# EAGLE schematic canSlaveV05 Abm (EAGLE 6.5.0)
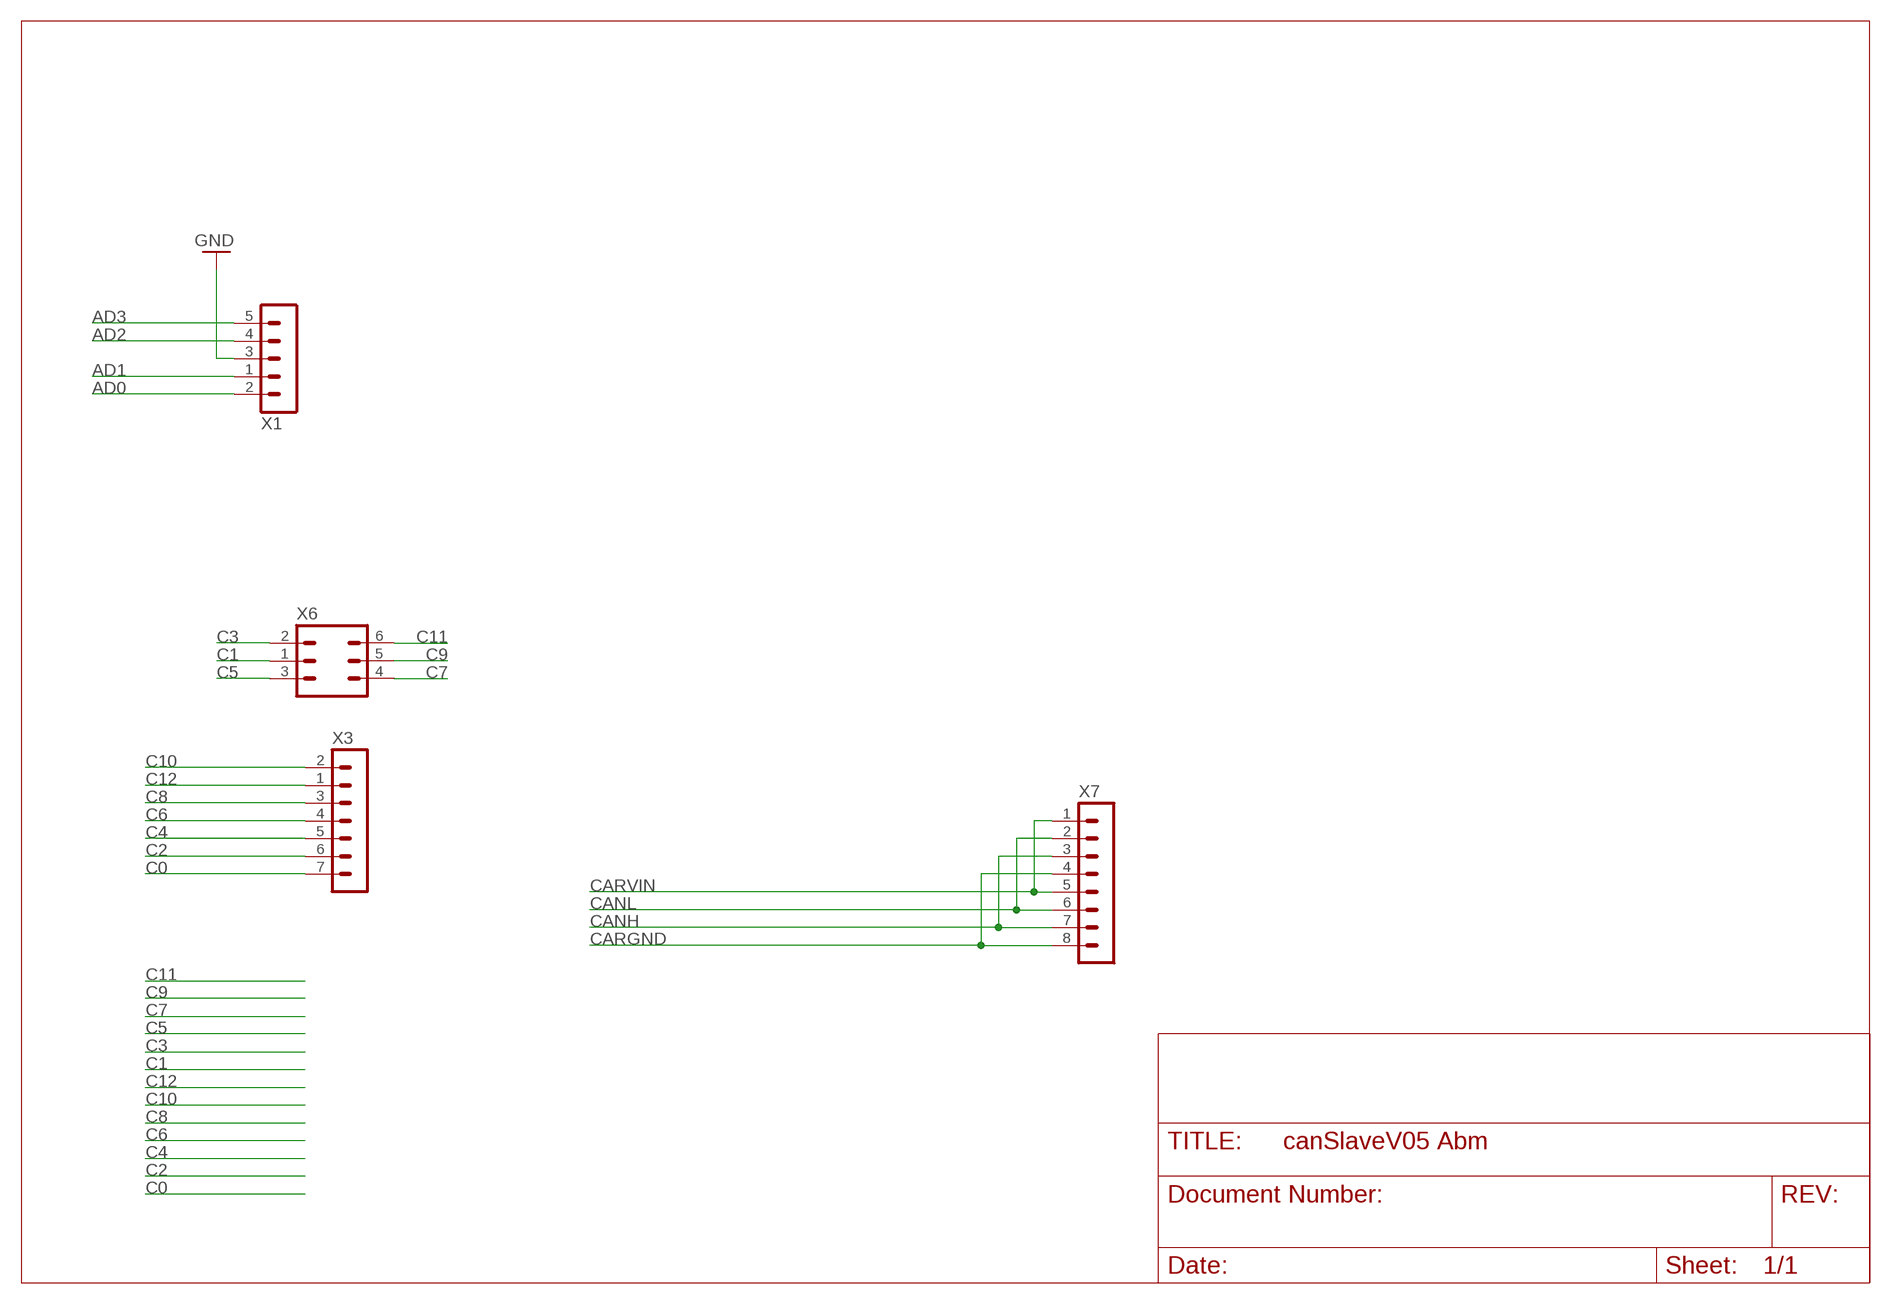
[diagram p0: schematic, sheet 1]

## Parts
X1  HEADER_POS5_43650-0509  [43650-0509]
X3  HEADER_POS7_43650-0709  [43650-0709]
X6  HEADER_POS6_43650-0609  [43650-0609]
X7  HEADER_POS8_43045-0800  [43045-0800]

## Nets
AD0: X1.2
AD1: X1.1
AD2: X1.4
AD3: X1.5
C0: X3.7
C1: X6.1
C2: X3.6
C3: X6.2
C4: X3.5
C5: X6.3
C6: X3.4
C7: X6.4
C8: X3.3
C9: X6.5
C10: X3.2
C11: X6.6
C12: X3.1
CANH: X7.3 X7.7
CANL: X7.2 X7.6
CARGND: X7.4 X7.8
CARVIN: X7.1 X7.5
GND: X1.3

## Library data of the parts
X1 = con-molex-micro-fit-3_0:HEADER_POS5_?: Molex - Micro-Fit 3.0 Series connector, 3.00mm (0.118") pitch header, 5 positions.
X3 = con-molex-micro-fit-3_0:HEADER_POS7_?: Molex - Micro-Fit 3.0 Series connector, 3.00mm (0.118") pitch header, 7 positions.
X6 = con-molex-micro-fit-3_0:HEADER_POS6_?: Molex - Micro-Fit 3.0 Series connector, 3.00mm (0.118") pitch header, 6 positions.
X7 = con-molex-micro-fit-3_0:HEADER_POS8_?: Molex - Micro-Fit 3.0 Series connector, 3.00mm (0.118") pitch header, 8 positions.